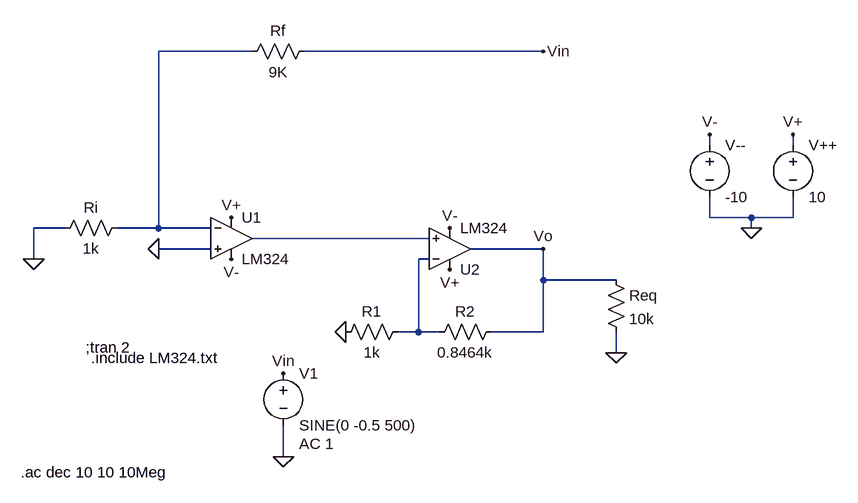
[diagram p0: schematic Lab3Circ1_MF.asc]
Lab3Circ1_MF.asc, the LTspice schematic file:
Version 4
SHEET 1 1424 680
WIRE 240 -128 96 -128
WIRE 688 -128 320 -128
WIRE 944 16 944 0
WIRE 1072 16 1072 0
WIRE 944 128 944 96
WIRE 1008 128 944 128
WIRE 1072 128 1072 96
WIRE 1072 128 1008 128
WIRE -48 144 -96 144
WIRE 96 144 96 -128
WIRE 96 144 32 144
WIRE 176 144 96 144
WIRE 1008 144 1008 128
WIRE 512 160 240 160
WIRE 176 176 96 176
WIRE 688 176 576 176
WIRE -96 192 -96 144
WIRE 512 192 496 192
WIRE 688 224 688 176
WIRE 800 224 688 224
WIRE 496 304 496 192
WIRE 496 304 464 304
WIRE 528 304 496 304
WIRE 688 304 688 224
WIRE 688 304 608 304
WIRE 800 336 800 304
WIRE 288 496 288 448
FLAG 1008 144 0
FLAG -96 192 0
FLAG 1072 0 V+
FLAG 208 128 V+
FLAG 944 0 V-
FLAG 208 192 V-
FLAG 288 496 0
FLAG 288 368 Vin
FLAG 544 144 V-
FLAG 544 208 V+
FLAG 688 176 Vo
FLAG 384 304 0
FLAG 688 -128 Vin
FLAG 96 176 0
FLAG 800 336 0
SYMBOL AutoGenerated\\LM324 208 96 R0
SYMATTR InstName U1
SYMBOL voltage 1072 0 R0
WINDOW 123 0 0 Left 0
WINDOW 39 24 124 Left 2
SYMATTR InstName V++
SYMATTR Value 10
SYMBOL voltage 944 0 R0
WINDOW 123 0 0 Left 0
WINDOW 39 24 124 Left 2
SYMATTR InstName V--
SYMATTR Value -10
SYMBOL res 48 128 R90
WINDOW 0 0 56 VBottom 2
WINDOW 3 32 56 VTop 2
SYMATTR InstName Ri
SYMATTR Value 1k
SYMBOL voltage 288 352 R0
WINDOW 123 24 124 Left 2
WINDOW 39 24 124 Left 2
SYMATTR Value2 AC 1
SYMATTR InstName V1
SYMATTR Value SINE(0 -0.5 500)
SYMBOL res 336 -144 R90
WINDOW 0 0 56 VBottom 2
WINDOW 3 32 56 VTop 2
SYMATTR InstName Rf
SYMATTR Value 9K
SYMBOL AutoGenerated\\LM324 544 240 M180
SYMATTR InstName U2
SYMBOL res 480 288 R90
WINDOW 0 0 56 VBottom 2
WINDOW 3 32 56 VTop 2
SYMATTR InstName R1
SYMATTR Value 1k
SYMBOL res 624 288 R90
WINDOW 0 0 56 VBottom 2
WINDOW 3 32 56 VTop 2
SYMATTR InstName R2
SYMATTR Value 0.8464k
SYMBOL res 784 208 R0
SYMATTR InstName Req
SYMATTR Value 10k
TEXT -16 328 Left 2 !;tran 2
TEXT -8 344 Left 2 !.include LM324.txt
TEXT -116 520 Left 2 !.ac dec 10 10 10Meg

The netlist it stands for:
* Lab3Circ1_MF.asc
* U1: LM324 (symbol AutoGenerated\LM324 not available, pins judged from their places): In+=0 In-=N001 V+=V+ V-=V- OUT=N002
V++ V+ 0 10
V-- V- 0 -10
Ri N001 0 1k
V1 Vin 0 SINE(0 -0.5 500) AC 1
Rf Vin N001 9K
* U2: LM324 (symbol AutoGenerated\LM324 not available, pins judged from their places): In+=N002 In-=N003 V+=V+ V-=V- OUT=Vo
R1 N003 0 1k
R2 Vo N003 0.8464k
Req Vo 0 10k
;tran 2
.include LM324.txt
.ac dec 10 10 10Meg
.backanno
.end